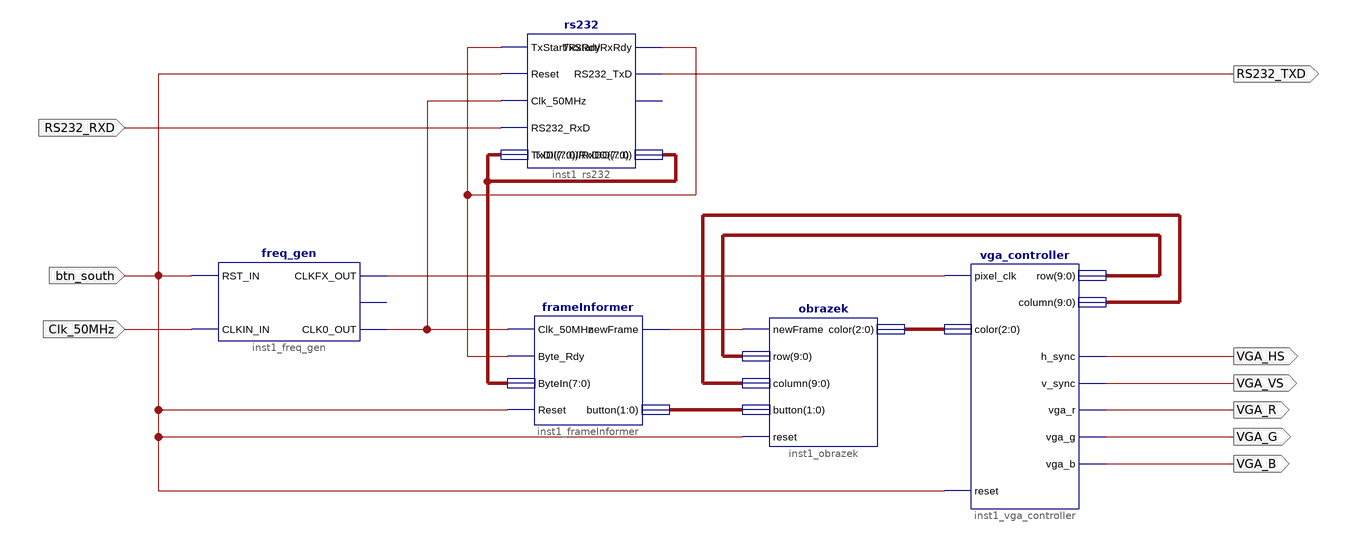
[diagram p0: schematic sheet 1]
// Xilinx ISE schematic schematic.sch (spartan3e) as structural Verilog: 5 symbols, 9 ports
module schematic (
  input  RS232_RXD,
  input  Clk_50MHz,
  input  btn_south,
  output VGA_R,
  output VGA_G,
  output VGA_B,
  output RS232_TXD,
  output VGA_HS,
  output VGA_VS
);

  wire XLXN_128, XLXN_161, XLXN_202, XLXN_214;
  wire [1:0] XLXN_125;
  wire [2:0] XLXN_37;
  wire [7:0] XLXN_131;
  wire [9:0] XLXN_215, XLXN_219;

  freq_gen inst1_freq_gen (
    .RST_IN(btn_south), .CLKIN_IN(Clk_50MHz), .CLKFX_OUT(XLXN_202), .CLK0_OUT(XLXN_161));  // open: CLKIN_IBUFG_OUT
  vga_controller inst1_vga_controller (
    .vga_r(VGA_R), .vga_g(VGA_G), .vga_b(VGA_B), .reset(btn_south), .pixel_clk(XLXN_202), .color(XLXN_37),
    .row(XLXN_215), .column(XLXN_219), .h_sync(VGA_HS), .v_sync(VGA_VS));
  rs232 inst1_rs232 (
    .TxStart(XLXN_128), .Reset(btn_south), .Clk_50MHz(XLXN_161), .RS232_RxD(RS232_RXD), .TxDI(XLXN_131),
    .RxRdy(XLXN_128), .RS232_TxD(RS232_TXD), .RxDO(XLXN_131));  // open: TxBusy
  frameInformer inst1_frameInformer (
    .Clk_50MHz(XLXN_161), .newFrame(XLXN_214), .Byte_Rdy(XLXN_128), .ByteIn(XLXN_131), .button(XLXN_125),
    .Reset(btn_south));
  obrazek inst1_obrazek (
    .reset(btn_south), .newFrame(XLXN_214), .row(XLXN_215), .column(XLXN_219), .button(XLXN_125),
    .color(XLXN_37));
endmodule
